# Altium schematic sheet QCopterFC_IMU_Sch.SchDoc
size A4
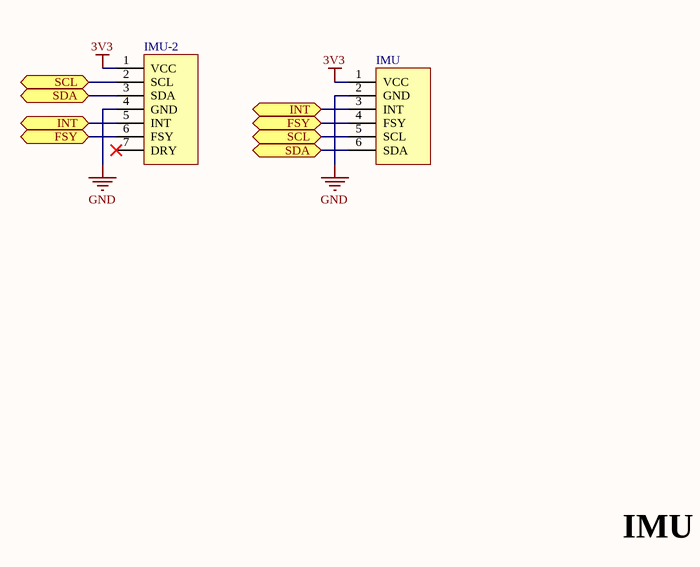
[diagram p0: QCopterFC_IMU_Sch.SchDoc]

## Parts
IMU  IMU  [IMU]
IMU-2  IMU-2  [IMU-2]  (value not drawn)

## Ports
FSY, INT, SCL, SDA

## Nets
3V3: IMU.1(VCC) IMU-2.1(VCC)
GND: IMU.2(GND) IMU-2.4(GND)
FSY: IMU.4(FSY) IMU-2.6(FSY) ; port FSY
INT: IMU.3(INT) IMU-2.5(INT) ; port INT
SCL: IMU.5(SCL) IMU-2.2(SCL) ; port SCL
SDA: IMU.6(SDA) IMU-2.3(SDA) ; port SDA

Not connected (* = marked no-connect by the designer): IMU-2 7(DRY)*

## Notes on the sheet
- IMU

## Library data of the parts
IMU = IMU: Module
IMU-2 = IMU-2: Module